# Altium project BAR_SENS.PrjPcb
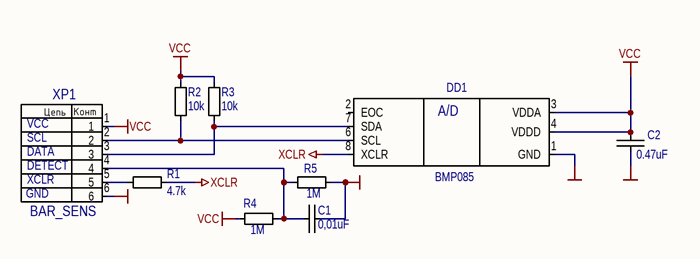
[diagram p0: BAR_SENS.SchDoc]
1 sheet, 9 parts. Net scope: global (net labels, ports and power ports of the same name join across sheets).
Board file: BAR_SENS.PcbDoc

## Sheet BAR_SENS.SchDoc
size 420 x 297 mm; Scale: {Масш.}; Title1str: {Наименование}; PageSetup: Record=PageOptions|CenterHorizontal=False|CenterVertical=False|PrintScale=0.67|XCorrection=0.00|YCorrection=0.00|PrintKind=1|BorderSize=5000000|LeftOffset=0|BottomOffset=0|Orientation=2|PaperLength=1000|PaperWidth=1000|Scale=100|PaperSource=7|PrintQuality=600|MediaType=1|DitherType=10|PaperKind=A4|PrintScaleMode=1; Title2str: {Наименование}; ProcessInspection: {Т.контр.}; Mass: {Масса}; NormInspection: {Н.контр.}; EngineerName: {Инженер}; Letter1Column: {}; Letter2Column: {}; Letter3Column: {}; DocumentType: ?????????????? ?????; DocumentType1str: {Документ}; DocumentType2str: {Документ}

### Parts
C1  0,01uF  [Cap_0805]
C2  0.47uF  [Cap_0805]
DD1  BMP085  [BMP085]
R1  4.7k  [Res_0805]
R2  10k  [Res_0805]
R3  10k  [Res_0805]
R4  1M  [Res_0805]
R5  1M  [Res_0805]
XP1  BAR_SENS  [SENS_LEGS]

### Nets
GND: C1.2 C2.1 DD1.1(GND) R5.1 XP1.6
VCC: C2.2 DD1.3(VDDA) DD1.4(VDDD) R2.1 R3.1 R4.2 XP1.1
XCLR: DD1.8(XCLR) R1.1
NetC1_1: C1.1 R4.1 R5.2 XP1.4
NetDD1_6: DD1.6(SCL) R2.2 XP1.2
NetDD1_7: DD1.7(SDA) R3.2 XP1.3
NetR1_2: R1.2 XP1.5

Not connected (* = marked no-connect by the designer): DD1 2(EOC)

### Notes on the sheet
- (near XP1) DETECT
- (near XP1) DATA
- (near XP1) SCL
- (near XP1) VCC
- (near XP1) XCLR
- GND
- (in symbol BMP085) A/D

### Library data of the parts
C1 = Cap_0805: Manufacturer: AVX; Part Number: 08055C103JAT2A; Replacement: GRM2195C1H103JA01D; Value: 0.01uF; PackageReference: 0805; Distributor: http://www.chipel.ru/; Price: 0.30
C2 = Cap_0805: Manufacturer: AVX; Part Number: 0805YC475KAT2A; Replacement: GRM21BR61E475KA12L; Value: 1uF; PackageReference: 0805; Distributor: http://www.kontest.ru; Price: 9.53
R1-R5 = Res_0805: Manufacturer: Vishay; Replacement: 0.30; PackageReference: 0805; Distributor: http://www.kontest.ru; Price: Price
  R1: Value: 4.7k
  R2 R3: Value: 10k
  R4 R5: Value: 1M